# EAGLE design babymidimultiplexgnusbuino (EAGLE 6.4)
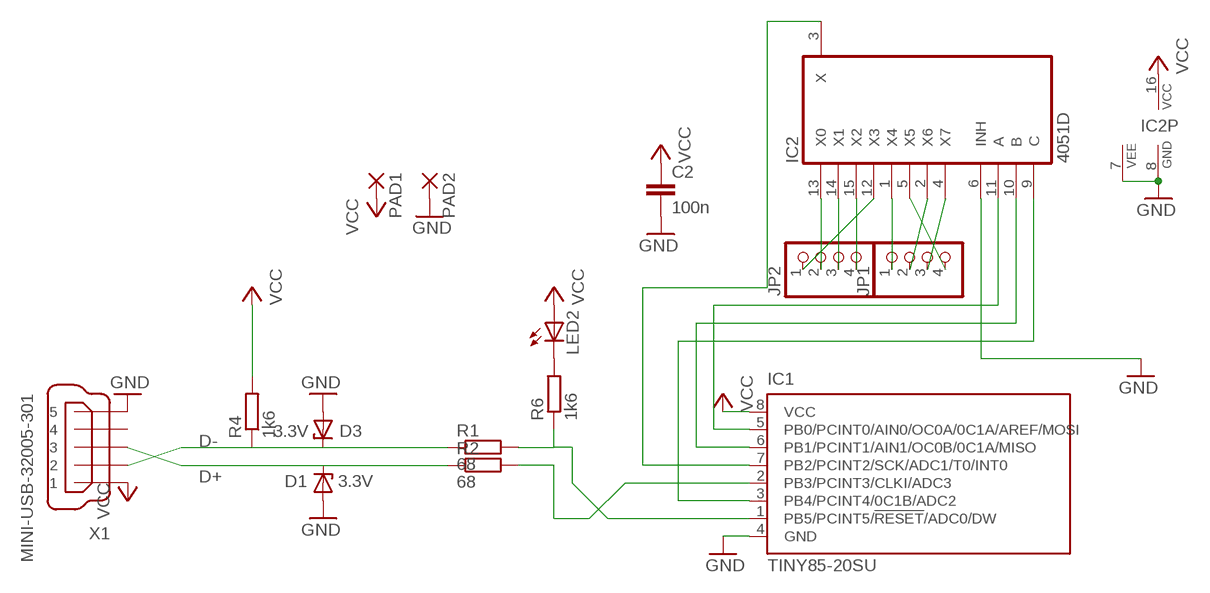
[diagram p0: schematic, sheet 1]

## Parts
C2  100n  C-EUC0603  [C0603]
D1  3.3V  ZENER-DIODESOD80C  [SOD80C]
D3  3.3V  ZENER-DIODESOD80C  [SOD80C]
IC1  TINY85-20SU  [8S2]
IC2  4051D  [SO16]
JP1  PINHD-1X4  [1X04]
JP2  PINHD-1X4  [1X04]
LED2  LEDKA-3528ASYC  [KA-3528ASYC]
PAD1  SMD5  [SMD2,54-5,08]
PAD2  SMD5  [SMD2,54-5,08]
R1  68  R-EU_R1206  [R1206]
R2  68  R-EU_R1206  [R1206]
R4  1k6  R-EU_R1206  [R1206]
R6  1k6  R-EU_R1206  [R1206]
X1  MINI-USB-32005-301  [32005-301]

## Nets
D+: D1.C R2.1 X1.3
D-: D3.C R1.1 R4.1 X1.2
GND: C2.2 D1.A D3.A IC1.4(GND) IC2.6(INH) IC2.7(VEE) IC2.8(GND) PAD2.1(P) X1.5
N$1: IC1.2(PB3/PCINT3/CLKI/ADC3) R2.2
N$2: IC1.1(PB5/PCINT5/!RESET!/ADC0/DW) R1.2 R6.1
N$3: IC1.7(PB2/PCINT2/SCK/ADC1/T0/INT0) IC2.3(X)
N$4: IC1.6(PB1/PCINT1/AIN1/OC0B/0C1A/MISO) IC2.10(B)
N$6: IC1.5(PB0/PCINT0/AIN0/OC0A/0C1A/AREF/MOSI) IC2.11(A)
N$7: IC1.3(PB4/PCINT4/0C1B/ADC2) IC2.9(C)
N$8: LED2.C R6.2
N$9: IC2.1(X4) JP1.1
N$10: IC2.2(X6) JP1.2
N$11: IC2.4(X7) JP1.3
N$12: IC2.5(X5) JP1.4
N$13: IC2.12(X3) JP2.1
N$14: IC2.13(X0) JP2.2
N$15: IC2.14(X1) JP2.3
N$16: IC2.15(X2) JP2.4
VCC: C2.1 IC1.8(VCC) IC2.16(VCC) LED2.A PAD1.1(P) R4.2 X1.1
Unconnected: X1.4

## Library data of the parts
C2 = rcl:C-EU: CAPACITOR, European symbol
D1 D3 = diode:ZENER-DIODE: Z-Diode
IC1 = anyma-lib:TINY85: 8-bit AVR Microcontroller with 1K Bytes In-System Programmable Flash Source: http://www.atmel.com/dyn/resources/prod_documents/2535S.pdf; MPN: ATTINY13-20SU; OC_FARNELL: 9171568; OC_NEWARK: 96K6522
IC2 = 40xx:4051: 8-channel ANALOG MULTIPLEXER
JP1 JP2 = pinhead:PINHD-1X4: PIN HEADER
LED2 = led:LED: LED OSRAM: - CHIPLED LG R971, LG N971, LY N971, LG Q971, LY Q971, LO R971, LY R971 LH N974, LH R974 LS Q976, LO Q976, LY Q976 LO Q996 - Hyper CHIPLED LW Q18S LB Q993, LB Q99A, LB R99A - SideLED LS A670, LO A670, LY A670, LG A670, LP A670 LB A673, LV A673, LT A673, LW A673 LH A674 LY A675 LS A676, LA A676, LO A676, LY A676, LW A676 LS A679, LY A679, LG A679 - Hyper Micro SIDELED® LS Y876, LA Y876, LO Y876, LY Y876 LT Y87S - SmartLED LW L88C, LW L88S LB L89C, LB L89S, LG L890 LS L89K, LO L89K, LY L89K LS L896, LA L896, LO L896, LY L896 - TOPLED LS T670, LO T670, LY T670, LG T670, LP T670 LSG T670, LSP T670, LSY T670, LOP T670, LYG T670 LG T671, LOG T671, LSG T671 LB T673, LV T673, LT T673, LW T673 LH T674 LS T676, LA T676, LO T676, LY T676, LB T676, LH T676, LSB T676, LW T676 LB T67C, LV T67C, LT T67C, LS T67K, LO T67K, LY T67K, LW E67C LS E67B, LA E67B, LO E67B, LY E67B, LB E67C, LV E67C, LT E67C LW T67C LS T679, LY T679, LG T679 LS T770, LO T770, LY T770, LG T770, LP T770 LB T773, LV T773, LT T773, LW T773 LH T774 LS E675, LA E675, LY E675, LS T675 LS T776, LA T776, LO T776, LY T776, LB T776 LHGB T686 LT T68C, LB T68C - Hyper Mini TOPLED® LB M676 - Mini TOPLED Santana® LG M470 LS M47K, LO M47K, LY M47K Source: http://www.osram.convergy.de LUXEON: - LUMILED® LXK2-PW12-R00, LXK2-PW12-S00, LXK2-PW14-U00, LXK2-PW14-V00 LXK2-PM12-R00, LXK2-PM12-S00, LXK2-PM14-U00 LXK2-PE12-Q00, LXK2-PE12-R00, LXK2-PE12-S00, LXK2-PE14-T00, LXK2-PE14-U00 LXK2-PB12-K00, LXK2-PB12-L00, LXK2-PB12-M00, LXK2-PB14-N00, LXK2-PB14-P00, LXK2-PB14-Q00 LXK2-PR12-L00, LXK2-PR12-M00, LXK2-PR14-Q00, LXK2-PR14-R00 LXK2-PD12-Q00, LXK2-PD12-R00, LXK2-PD12-S00 LXK2-PH12-R00, LXK2-PH12-S00 LXK2-PL12-P00, LXK2-PL12-Q00, LXK2-PL12-R00 Source: www.luxeon.com KINGBRIGHT: KA-3528ASYC Source: www.kingbright.com
PAD1 PAD2 = wirepad:SMD5: SMD PAD
R1 R2 R4 R6 = rcl:R-EU_: RESISTOR, European symbol
X1 = con-cypressindustries:MINI-USB-: MINI USB-B Conector Source: www.cypressindustries.com; OC_FARNELL: unknown; OC_NEWARK: unknown

## Board
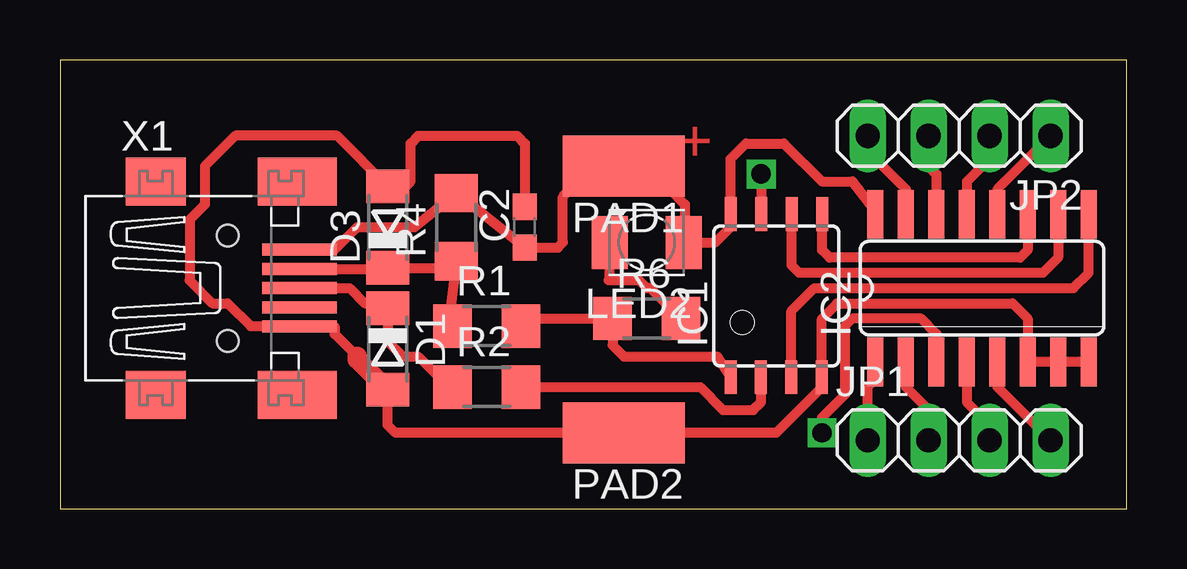
[diagram p1: board, top side]
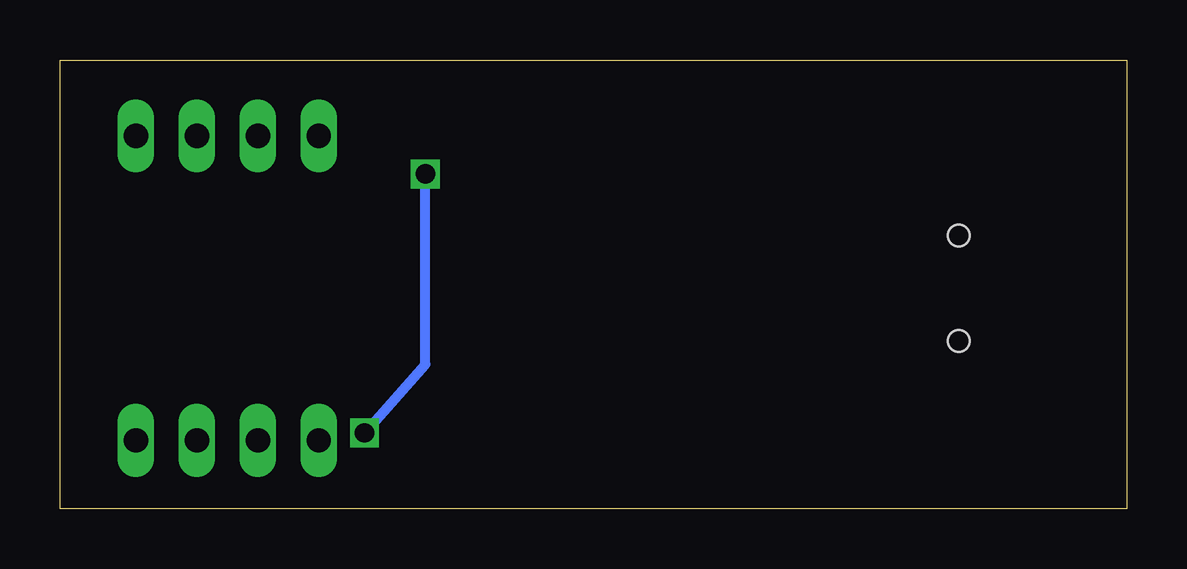
[diagram p2: board, bottom side, seen from below]

Size 44.44 x 18.72 mm. Coordinates in mm from the lower left corner, seen from the top.
Outline: 0,0 44.44,0 44.44,18.72 0,18.72 0,0
Copper layers (1*16): Top 0.035mm / dielectric 1.5mm / Bottom 0.035mm
Design rules "default": minimum track width 10mil, minimum drill 24mil, track to track 8mil, track to pad 8mil, pad to pad 8mil, via to via 8mil, smd to smd 8mil, copper to edge 40mil, drill to drill 8mil, minimum pad ring 10mil, minimum via ring 8mil, stop-mask expansion 4mil, vias tented up to drill 0mil, thermal gap 10mil

### Footprints (pad centres in the part's own frame; a part is rotated, then mirrored left to right if it is on the bottom)
C0603 = smd 1.1 x 1: 1 -0.85,0; 2 0.85,0
SOD80C = smd 1.4 x 1.8: A 1.7,0; C -1.7,0
8S2 = smd 0.5 x 1.4: 1 -1.905,-3.404; 2 -0.645,-3.404; 3 0.625,-3.404; 4 1.895,-3.404; 5 1.905,3.404; 6 0.635,3.404; 7 -0.635,3.404; 8 -1.905,3.404
SO16 = smd 0.66 x 2.032: 1 -4.445,-3.073; 2 -3.175,-3.073; 3 -1.905,-3.073; 4 -0.635,-3.073; 5 0.635,-3.073; 6 1.905,-3.073; 7 3.175,-3.073; 8 4.445,-3.073; 9 4.445,3.073; 10 3.175,3.073; 11 1.905,3.073; 12 0.635,3.073; 13 -0.635,3.073; 14 -1.905,3.073; 15 -3.175,3.073; 16 -4.445,3.073
1X04 = drill 1.016 long: 1 -3.81,0; 2 -1.27,0; 3 1.27,0; 4 3.81,0
KA-3528ASYC = smd 1.5 x 2.2: A -1.55,0; C 1.55,0
SMD2,54-5,08 = smd 2.54 x 5.08: 1 0,0
R1206 = smd 1.6 x 1.803: 1 -1.422,0; 2 1.422,0
32005-301 = smd 3.1 x 0.5: 1 3,1.6; 2 3,0.8; 3 3,0; 4 3,-0.8; 5 3,-1.6 | smd 2.5 x 2: M1 -3,-4.45; M2 -3,4.45 | smd 3.3 x 2: M3 2.9,4.45; M4 2.9,-4.45 | hole 0.9: 0,2.2; 0,-2.2

### Placement (x,y rotation side)
C2  19.37,11.75 90 top
D1  13.65,6.67 270 top
D3  13.65,11.75 90 top
IC1  29.84,8.89 0 top
IC2  38.42,9.21 0 top
JP1  37.46,2.86 0 top
JP2  37.46,15.56 180 top
LED2  24.45,11.11 180 top
PAD1  23.49,14.29 90 top
PAD2  23.49,3.17 90 top
R1  17.78,7.62 0 top
R2  17.78,5.08 0 top
R4  16.51,11.75 90 top
R6  24.45,7.94 0 top
X1  6.99,9.21 0 top

### Tracks (layer width: path | path; a pad name or v marks a point on that pad's centre or on a via)
D+
  Top 0.406: X1.3 12.07,9.21 12.7,8.57 13.45,8.57 D1.C 13.65,6.99 14.29,6.35 14.92,6.35 16.19,5.08 R2.1
D-
  Top 0.406: X1.2 13.61,10.01 D3.C 15.92,10.05 R4.1 16.19,7.79 R1.1
GND
  Top 0.406: IC2.8 IC2.7 IC2.6 40.32,7.94 39.69,8.57 32.38,8.57 31.74,7.93 IC1.4 31.74,5.07 29.84,3.17 PAD2.1 13.97,3.17 13.65,3.49 D1.A | C2.2 19.37,15.24 19.05,15.56 14.92,15.56 14.61,15.24 14.61,13.65 14.4,13.45 D3.A 11.54,15.56 7.3,15.56 6.03,14.29 6.03,12.7 5.4,12.06 5.4,9.52 6.35,8.57 6.99,8.57 7.94,7.62 8.89,7.62 8.9,7.61 X1.5 11.44,7.61 11.44,7.29 12.38,6.35
  Top 0.813: 12.38,6.35 12.38,6.24 D1.A
N$1
  Top 0.406: R2.2 26.67,5.08 27.62,4.13 28.89,4.13 29.21,4.45 29.21,5.48 IC1.2
N$2
  Top 0.406: R1.2 19.52,7.94 R6.1 23.02,6.82 23.49,6.35 27.39,6.35 IC1.1
N$3  (via drill 0.8)
  Top 0.406: IC2.3 36.51,7.3 35.88,7.94 33.02,7.94 32.7,7.62 32.7,4.76 31.75,3.81 v31.75,3.17 | v29.21,13.97 IC1.7
  Bottom 0.406: v31.75,3.17 29.21,6.03 v29.21,13.97
N$4
  Top 0.406: IC2.10 41.59,10.48 40.96,9.84 30.8,9.84 30.48,10.16 IC1.6
N$6
  Top 0.406: IC2.11 40.32,10.8 40,10.48 32.07,10.48 31.75,10.8 IC1.5
N$7
  Top 0.406: IC1.3 30.47,8.24 31.43,9.21 42.23,9.21 42.86,9.84 IC2.9
N$8
  Top 0.406: R6.2 24.6,9.21 24.45,9.21 24.13,9.52 22.86,9.52 22.9,9.56 LED2.C
N$9
  Top 0.406: JP1.1 33.66,5.08 33.97,5.4 IC2.1
N$10
  Top 0.406: IC2.2 35.24,5.08 36.2,4.13 JP1.2
N$11
  Top 0.406: IC2.4 37.78,4.45 38.73,3.49 JP1.3
N$12
  Top 0.406: IC2.5 39.05,5.08 JP1.4
N$13
  Top 0.406: JP2.1 39.05,13.34 IC2.12
N$14
  Top 0.406: JP2.2 38.73,14.29 38.42,14.29 37.78,13.65 IC2.13
N$15
  Top 0.406: JP2.3 36.2,14.29 36.51,13.97 IC2.14
N$16
  Top 0.406: JP2.4 33.66,14.92 35.24,13.34 IC2.15
VCC
  Top 0.406: X1.1 11.44,10.81 12.38,11.75 14.77,11.75 R4.2 C2.1 20.74,10.9 20.95,11.11 20.95,13.02 21.27,13.34 23.18,13.34 | 23.18,13.34 25.4,13.34 26.04,12.7 26.04,11.15 LED2.A 27.3,11.11 27.94,11.75 IC1.8 27.94,14.6 28.57,15.24 30.16,15.24 31.75,13.65 33.02,13.65 34.07,12.28 IC2.16 | PAD1.1 23.49,13.65 23.18,13.34

### Text on the board
Top: +